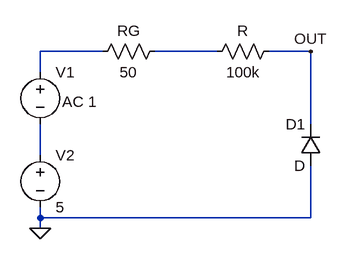
[diagram p0: schematic ej3_simulacion.asc]
ej3_simulacion.asc, the LTspice schematic file:
Version 4
SHEET 1 880 680
WIRE 160 80 64 80
WIRE 336 80 240 80
WIRE 480 80 416 80
WIRE 64 112 64 80
WIRE 480 192 480 80
WIRE 64 240 64 192
WIRE 64 336 64 320
WIRE 480 336 480 256
WIRE 480 336 64 336
WIRE 64 352 64 336
FLAG 64 352 0
FLAG 480 80 OUT
SYMBOL voltage 64 96 R0
WINDOW 123 34 61 Left 2
WINDOW 39 0 0 Left 2
SYMATTR InstName V1
SYMATTR Value ""
SYMATTR Value2 AC 1
SYMBOL voltage 64 224 R0
WINDOW 123 0 0 Left 2
WINDOW 39 0 0 Left 2
SYMATTR InstName V2
SYMATTR Value 5
SYMBOL res 256 64 R90
WINDOW 0 0 56 VBottom 2
WINDOW 3 32 56 VTop 2
SYMATTR InstName RG
SYMATTR Value 50
SYMBOL res 432 64 R90
WINDOW 0 0 56 VBottom 2
WINDOW 3 32 56 VTop 2
SYMATTR InstName R
SYMATTR Value 100k
SYMBOL diode 496 256 R180
WINDOW 0 24 64 Left 2
WINDOW 3 24 0 Left 2
SYMATTR InstName D1

The netlist it stands for:
* ej3_simulacion.asc
V1 N001 N003 AC 1
V2 N003 0 5
RG N002 N001 50
R OUT N002 100k
D1 0 OUT D
.model D D
.lib standard.dio
.backanno
.end